# EAGLE design steady_mega_shield_v1.4 (EAGLE 9.4.1)
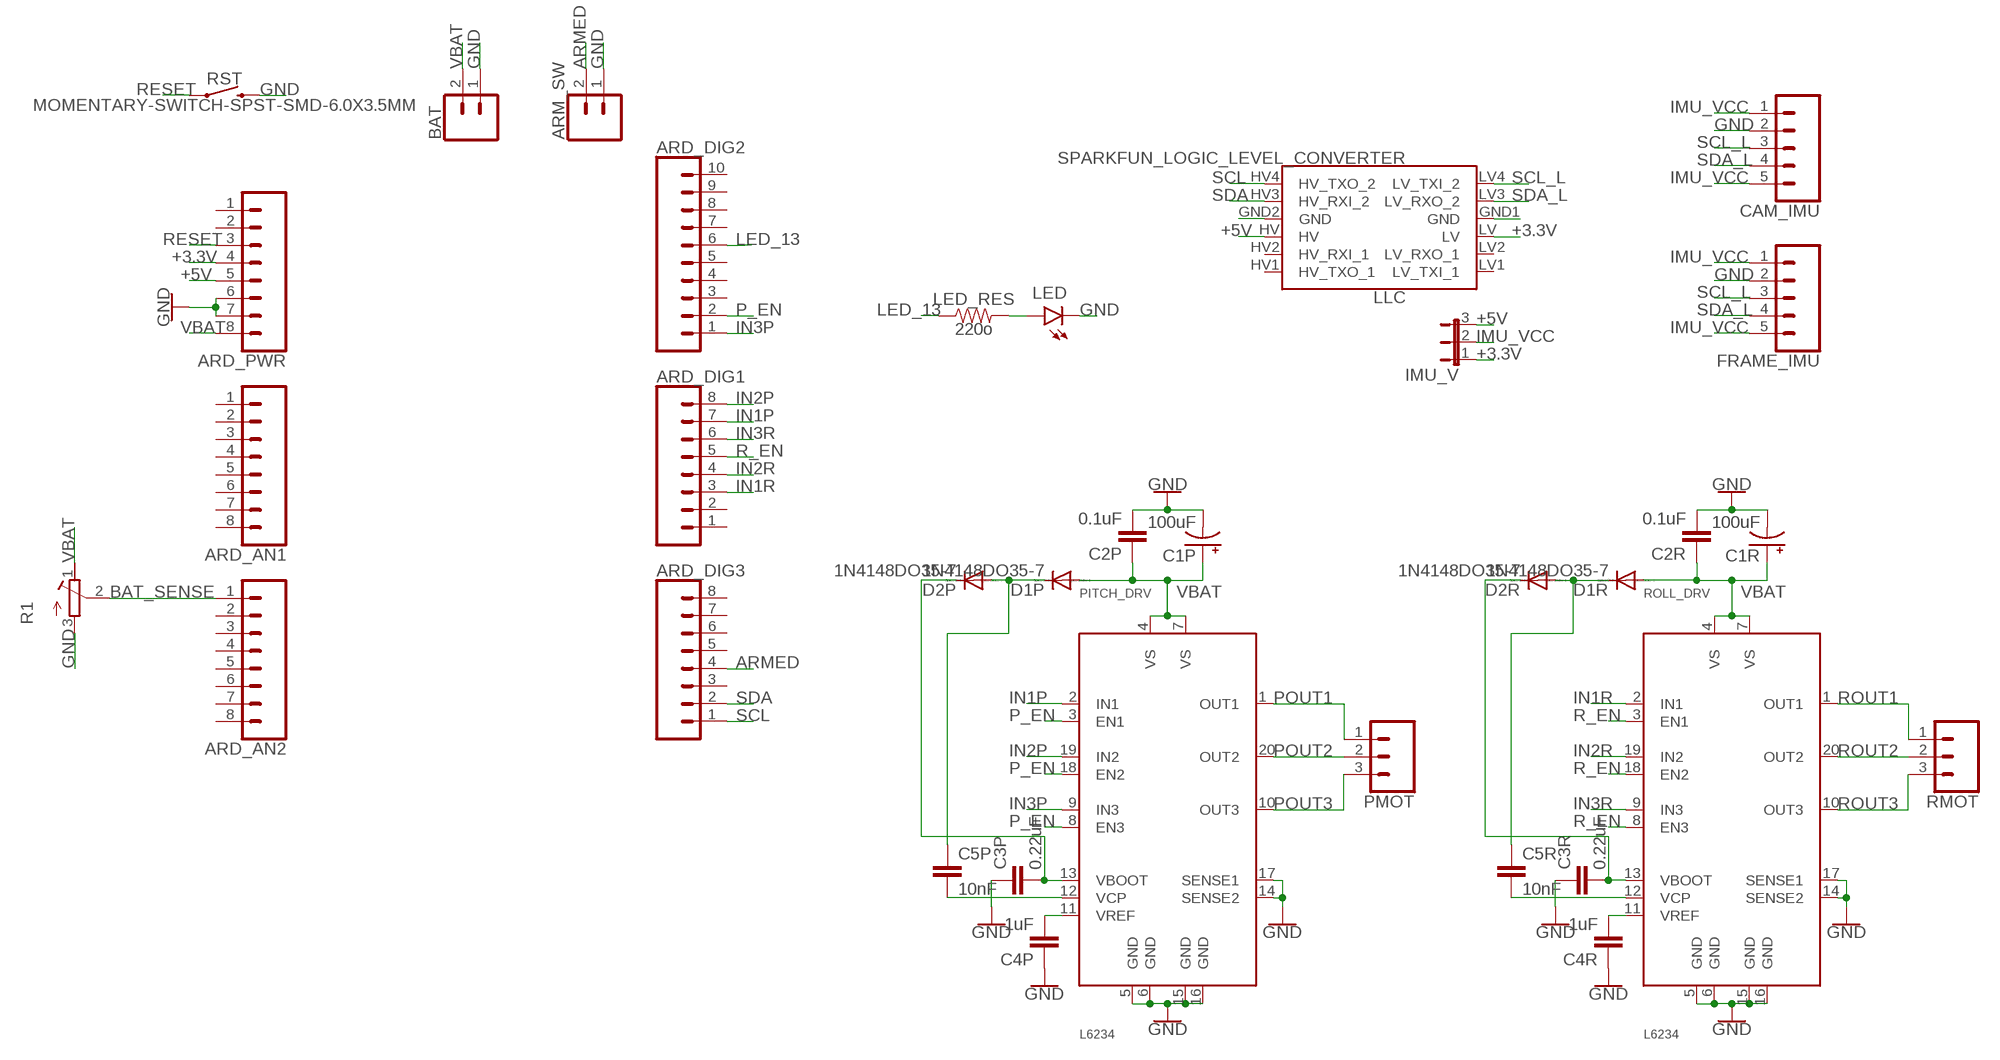
[diagram p0: schematic, sheet 1]

## Parts
ARD_AN1  CONN_08"  [1X08]
ARD_AN2  CONN_08"  [1X08]
ARD_DIG1  CONN_08"  [1X08]
ARD_DIG2  CONN_10"  [1X10]
ARD_DIG3  CONN_08"  [1X08]
ARD_PWR  CONN_08"  [1X08]
ARM_SW  CONN_02  [1X02]
BAT  CONN_02  [1X02]
C1P  100uF  100UF-POLAR-RADIAL-2.5MM-25V-20%  [CPOL-RADIAL-2.5MM-6.5MM]
C1R  100uF  100UF-POLAR-RADIAL-2.5MM-25V-20%  [CPOL-RADIAL-2.5MM-6.5MM]
C2P  0.1uF  C-EU025-024X044  [C025-024X044]
C2R  0.1uF  C-EU025-024X044  [C025-024X044]
C3P  0.22uF  C5/2.5  [C5B2.5]
C3R  0.22uF  C5/2.5  [C5B2.5]
C4P  1uF  C5/5.5  [C5B5.5]
C4R  1uF  C5/5.5  [C5B5.5]
C5P  10nF  C5/2.5  [C5B2.5]
C5R  10nF  C5/2.5  [C5B2.5]
CAM_IMU  CONN_05JST  [JST-5-PTH]
D1P  1N4148DO35-7  [DO35-7]
D1R  1N4148DO35-7  [DO35-7]
D2P  1N4148DO35-7  [DO35-7]
D2R  1N4148DO35-7  [DO35-7]
FRAME_IMU  CONN_05JST  [JST-5-PTH]
IMU_V  JP2E  [JP2]
LED  LED3MM  [LED_3MM]
LED_RES  220o  RESISTOR0805  [0805]
LLC  SPARKFUN_LOGIC_LEVEL_CONVERTER  [SPARKFUN_LOGIC_LEVEL_CONVERTER]
PITCH_DRV  L6234  [DIL20]
PMOT  CONN_03POLAR  [MOLEX-1X3]
R1  R-TRIMMT93XB  [RTRIMT93XB]
RMOT  CONN_03POLAR  [MOLEX-1X3]
ROLL_DRV  L6234  [DIL20]
RST  MOMENTARY-SWITCH-SPST-SMD-6.0X3.5MM  [TACTILE_SWITCH_SMD_6.0X3.5MM]

## Nets
+3.3V: ARD_PWR.4 IMU_V.1 LLC.LV
+5V: ARD_PWR.5 IMU_V.3 LLC.HV
ARMED: ARD_DIG3.4 ARM_SW.2
BAT_SENSE: ARD_AN2.1 R1.2(S)
GND: ARD_PWR.6 ARD_PWR.7 ARM_SW.1 BAT.1 C1P.2(-) C1R.2(-) C2P.2 C2R.2 C3P.1 C3R.1 C4P.1 C4R.1 CAM_IMU.2 FRAME_IMU.2 LED.K(C) LLC.GND1(GND) LLC.GND2(GND) PITCH_DRV.5(GND) PITCH_DRV.6(GND) PITCH_DRV.14(SENSE2) PITCH_DRV.15(GND) PITCH_DRV.16(GND) PITCH_DRV.17(SENSE1) R1.3(A) ROLL_DRV.5(GND) ROLL_DRV.6(GND) ROLL_DRV.14(SENSE2) ROLL_DRV.15(GND) ROLL_DRV.16(GND) ROLL_DRV.17(SENSE1) RST.2
IMU_VCC: CAM_IMU.1 CAM_IMU.5 FRAME_IMU.1 FRAME_IMU.5 IMU_V.2
IN1P: ARD_DIG1.7 PITCH_DRV.2(IN1)
IN1R: ARD_DIG1.3 ROLL_DRV.2(IN1)
IN2P: ARD_DIG1.8 PITCH_DRV.19(IN2)
IN2R: ARD_DIG1.4 ROLL_DRV.19(IN2)
IN3P: ARD_DIG2.1 PITCH_DRV.9(IN3)
IN3R: ARD_DIG1.6 ROLL_DRV.9(IN3)
LED_13: ARD_DIG2.6 LED_RES.1
N$1: C4R.2 ROLL_DRV.11(VREF)
N$2: C4P.2 PITCH_DRV.11(VREF)
N$3: C5R.2 ROLL_DRV.12(VCP)
N$4: C3R.2 D2R.C ROLL_DRV.13(VBOOT)
N$5: C5P.2 PITCH_DRV.12(VCP)
N$6: C3P.2 D2P.C PITCH_DRV.13(VBOOT)
N$7: LED.A LED_RES.2
N$13: C5P.1 D1P.C D2P.A
N$14: C5R.1 D1R.C D2R.A
P_EN: ARD_DIG2.2 PITCH_DRV.3(EN1) PITCH_DRV.8(EN3) PITCH_DRV.18(EN2)
POUT1: PITCH_DRV.1(OUT1) PMOT.1
POUT2: PITCH_DRV.20(OUT2) PMOT.2
POUT3: PITCH_DRV.10(OUT3) PMOT.3
R_EN: ARD_DIG1.5 ROLL_DRV.3(EN1) ROLL_DRV.8(EN3) ROLL_DRV.18(EN2)
RESET: ARD_PWR.3 RST.1
ROUT1: RMOT.1 ROLL_DRV.1(OUT1)
ROUT2: RMOT.2 ROLL_DRV.20(OUT2)
ROUT3: RMOT.3 ROLL_DRV.10(OUT3)
SCL: ARD_DIG3.1 LLC.HV4(HV_TXO_2)
SCL_L: CAM_IMU.3 FRAME_IMU.3 LLC.LV4(LV_TXI_2)
SDA: ARD_DIG3.2 LLC.HV3(HV_RXI_2)
SDA_L: CAM_IMU.4 FRAME_IMU.4 LLC.LV3(LV_RXO_2)
VBAT: ARD_PWR.8 BAT.2 C1P.1(+) C1R.1(+) C2P.1 C2R.1 D1P.A D1R.A PITCH_DRV.4(VS) PITCH_DRV.7(VS) R1.1(E) ROLL_DRV.4(VS) ROLL_DRV.7(VS)
Unconnected: ARD_AN1.1 ARD_AN1.2 ARD_AN1.3 ARD_AN1.4 ARD_AN1.5 ARD_AN1.6 ARD_AN1.7 ARD_AN1.8 ARD_AN2.2 ARD_AN2.3 ARD_AN2.4 ARD_AN2.5 ARD_AN2.6 ARD_AN2.7 ARD_AN2.8 ARD_DIG1.1 ARD_DIG1.2 ARD_DIG2.3 ARD_DIG2.4 ARD_DIG2.5 ARD_DIG2.7 ARD_DIG2.8 ARD_DIG2.9 ARD_DIG2.10 ARD_DIG3.3 ARD_DIG3.5 ARD_DIG3.6 ARD_DIG3.7 ARD_DIG3.8 ARD_PWR.1 ARD_PWR.2 LLC.HV1(HV_TXO_1) LLC.HV2(HV_RXI_1) LLC.LV1(LV_TXI_1) LLC.LV2(LV_RXO_1)

## Library data of the parts
ARD_AN1 ARD_AN2 ARD_DIG1 ARD_DIG3 ARD_PWR = SparkFun-Connectors:CONN_08: Multi connection point. Often used as Generic Header-pin footprint for 0.1 inch spaced/style header connections On any of the 0.1 inch spaced packages, you can populate with these: Break Away Headers - Straight <https://www.sparkfun.com/products/116> (PRT-00116) Break Away Male Headers - Right Angle <https://www.sparkfun.com/products/553> (PRT-00553) Female Headers <https://www.sparkfun.com/products/115> (PRT-00115) Break Away Headers - Machine Pin <https://www.sparkfun.com/products/117> (PRT-00117) Break Away Female Headers - Swiss Machine Pin <https://www.sparkfun.com/products/743> (PRT-00743) Arduino Stackable Header - 8 Pin <https://www.sparkfun.com/products/9279> (PRT-09279) For SCREWTERMINALS and SPRING TERMINALS visit here: Screw Terimnals on SparkFun.com <https://www.sparkfun.com/search/results?term=Screw+Terminals> (5mm/3.5mm/2.54mm spacing) This device is also useful as a general connection point to wire up your design to another part of your project. Our various solder wires solder well into these plated through hole pads. Hook-Up Wire - Assortment (Stranded, 22 AWG) <https://www.sparkfun.com/products/11375> (PRT-11375) Hook-Up Wire - Assortment (Solid Core, 22 AWG) <https://www.sparkfun.com/products/11367> (PRT-11367) View the entire wire category on our website here <https://www.sparkfun.com/categories/141> Special notes: Molex polarized connector foot print use with SKU : PRT-08231 with associated crimp pins and housings. 1MM SMD Version SKU: PRT-10208 NOTES ON THE VARIANTS LOCK and LOCK_LONGPADS... This footprint was designed to help hold the alignment of a through-hole component (i.e. 6-pin header) while soldering it into place. You may notice that each hole has been shifted either up or down by 0.005 of an inch from it's more standard position (which is a perfectly straight line). This slight alteration caused the pins (the squares in the middle) to touch the edges of the holes. Because they are alternating, it causes a "brace" to hold the component in place. 0.005 has proven to be the perfect amount of "off-center" position when using our standard breakaway headers. Although looks a little odd when you look at the bare footprint, once you have a header in there, the alteration is very hard to notice. Also,if you push a header all the way into place, it is covered up entirely on the bottom side.; PROD_ID: CONN-08438
ARD_DIG2 = SparkFun-Connectors:CONN_10: Multi connection point. Often used as Generic Header-pin footprint for 0.1 inch spaced/style header connections On any of the 0.1 inch spaced packages, you can populate with these: Break Away Headers - Straight <https://www.sparkfun.com/products/116> (PRT-00116) Break Away Male Headers - Right Angle <https://www.sparkfun.com/products/553> (PRT-00553) Female Headers <https://www.sparkfun.com/products/115> (PRT-00115) Break Away Headers - Machine Pin <https://www.sparkfun.com/products/117> (PRT-00117) Break Away Female Headers - Swiss Machine Pin <https://www.sparkfun.com/products/743> (PRT-00743) Arduino Stackable Header - 10 Pin <https://www.sparkfun.com/products/11376> (PRT-11376) For SCREWTERMINALS and SPRING TERMINALS visit here: Screw Terimnals on SparkFun.com <https://www.sparkfun.com/search/results?term=Screw+Terminals> (5mm/3.5mm/2.54mm spacing) This device is also useful as a general connection point to wire up your design to another part of your project. Our various solder wires solder well into these plated through hole pads. Hook-Up Wire - Assortment (Stranded, 22 AWG) <https://www.sparkfun.com/products/11375> (PRT-11375) Hook-Up Wire - Assortment (Solid Core, 22 AWG) <https://www.sparkfun.com/products/11367> (PRT-11367) View the entire wire category on our website here <https://www.sparkfun.com/categories/141> Special notes: Molex polarized connector foot print use with SKU : PRT-08231 with associated crimp pins and housings. 1MM SMD Version SKU: PRT-10208 NOTES ON THE VARIANTS LOCK and LOCK_LONGPADS... This footprint was designed to help hold the alignment of a through-hole component (i.e. 6-pin header) while soldering it into place. You may notice that each hole has been shifted either up or down by 0.005 of an inch from it's more standard position (which is a perfectly straight line). This slight alteration caused the pins (the squares in the middle) to touch the edges of the holes. Because they are alternating, it causes a "brace" to hold the component in place. 0.005 has proven to be the perfect amount of "off-center" position when using our standard breakaway headers. Although looks a little odd when you look at the bare footprint, once you have a header in there, the alteration is very hard to notice. Also,if you push a header all the way into place, it is covered up entirely on the bottom side.; PROD_ID: CONN-11563
ARM_SW BAT = SparkFun-Connectors:CONN_02: Multi connection point. Often used as Generic Header-pin footprint for 0.1 inch spaced/style header connections On any of the 0.1 inch spaced packages, you can populate with these: Break Away Headers - Straight <https://www.sparkfun.com/products/116> (PRT-00116) Break Away Male Headers - Right Angle <https://www.sparkfun.com/products/553> (PRT-00553) Female Headers <https://www.sparkfun.com/products/115> (PRT-00115) Break Away Headers - Machine Pin <https://www.sparkfun.com/products/117> (PRT-00117) Break Away Female Headers - Swiss Machine Pin <https://www.sparkfun.com/products/743> (PRT-00743) For SCREWTERMINALS and SPRING TERMINALS visit here: Screw Terimnals on SparkFun.com <https://www.sparkfun.com/search/results?term=Screw+Terminals> (5mm/3.5mm/2.54mm spacing) This device is also useful as a general connection point to wire up your design to another part of your project. Our various solder wires solder well into these plated through hole pads. Hook-Up Wire - Assortment (Stranded, 22 AWG) <https://www.sparkfun.com/products/11375> (PRT-11375) Hook-Up Wire - Assortment (Solid Core, 22 AWG) <https://www.sparkfun.com/products/11367> (PRT-11367) View the entire wire category on our website here <https://www.sparkfun.com/categories/141> Special notes: Molex polarized connector foot print use with: PRT-08233 with associated crimp pins and housings. 2.54_SCREWTERM for use with PRT-10571. 3.5mm Screw Terminal footprints for PRT-08084 5mm Screw Terminal footprints for use with PRT-08432
C1P C1R = SparkFun-Capacitors:100UF-POLAR: 100µF polarized capacitors A capacitor is a passive two-terminal electrical component used to store electrical energy temporarily in an electric field.; PROD_ID: CAP-08439
C2P C2R = resistor:C-EU: CAPACITOR, European symbol
C3P C3R C4P C4R C5P C5R = capacitor-wima:C: CAPACITOR naming: grid - package width
CAM_IMU FRAME_IMU = SparkFun-Connectors:CONN_05: Multi connection point. Often used as Generic Header-pin footprint for 0.1 inch spaced/style header connections On any of the 0.1 inch spaced packages, you can populate with these: Break Away Headers - Straight <https://www.sparkfun.com/products/116> (PRT-00116) Break Away Male Headers - Right Angle <https://www.sparkfun.com/products/553> (PRT-00553) Female Headers <https://www.sparkfun.com/products/115> (PRT-00115) Break Away Headers - Machine Pin <https://www.sparkfun.com/products/117> (PRT-00117) Break Away Female Headers - Swiss Machine Pin <https://www.sparkfun.com/products/743> (PRT-00743) For SCREWTERMINALS and SPRING TERMINALS visit here: Screw Terimnals on SparkFun.com <https://www.sparkfun.com/search/results?term=Screw+Terminals> (5mm/3.5mm/2.54mm spacing) This device is also useful as a general connection point to wire up your design to another part of your project. Our various solder wires solder well into these plated through hole pads. Hook-Up Wire - Assortment (Stranded, 22 AWG) <https://www.sparkfun.com/products/11375> (PRT-11375) Hook-Up Wire - Assortment (Solid Core, 22 AWG) <https://www.sparkfun.com/products/11367> (PRT-11367) View the entire wire category on our website here <https://www.sparkfun.com/categories/141> Special notes: Molex polarized connector foot print use with SKU : PRT-08231 with associated crimp pins and housings. 1MM SMD Version SKU: PRT-10208; SF_ID: PRT-09917
D1P D1R D2P D2R = diode:1N4148: DIODE high speed (Philips)
IMU_V = jumper:JP2E: JUMPER
LED = SparkFun-LED:LED: LED (Generic) Standard schematic elements and footprints for 5mm, 3mm, 1206, and 0603 sized LEDs. Generic LEDs with no color specified.; PROD_ID: DIO-08794
LED_RES = SparkFun-Resistors:RESISTOR: Generic Resistor Package
LLC = SparkFun-Boards:SPARKFUN_LOGIC_LEVEL_CONVERTER: SparkFun Logic Level Converter -Bi-Directional This is the mechnical outline for the 3.3V - 5V bi directional logic level converter. *Note, the "LOCK" Package has the header pins staggered by an offset of 5 mils (off center line), so that when you slide a row of standard 0.1" headers into the PTH pads, it will hold position vertically. See the follwing turorial for more information on this type of special footprints: Sneaky Footprints <https://www.sparkfun.com/tutorials/114> SparkFun Products: SparkFun Logic Level Converter - Bi-Directional <https://www.sparkfun.com/products/12009>
PITCH_DRV ROLL_DRV = gto:L6234
PMOT RMOT = SparkFun-Connectors:CONN_03: Multi connection point. Often used as Generic Header-pin footprint for 0.1 inch spaced/style header connections On any of the 0.1 inch spaced packages, you can populate with these: Break Away Headers - Straight <https://www.sparkfun.com/products/116> (PRT-00116) Break Away Male Headers - Right Angle <https://www.sparkfun.com/products/553> (PRT-00553) Female Headers <https://www.sparkfun.com/products/115> (PRT-00115) Break Away Headers - Machine Pin <https://www.sparkfun.com/products/117> (PRT-00117) Break Away Female Headers - Swiss Machine Pin <https://www.sparkfun.com/products/743> (PRT-00743) Stackable Header - 3 Pin (Female, 0.1") <https://www.sparkfun.com/products/13875> (PRT-13875) For SCREWTERMINALS and SPRING TERMINALS visit here: Screw Terimnals on SparkFun.com <https://www.sparkfun.com/search/results?term=Screw+Terminals> (5mm/3.5mm/2.54mm spacing) This device is also useful as a general connection point to wire up your design to another part of your project. Our various solder wires solder well into these plated through hole pads. Hook-Up Wire - Assortment (Stranded, 22 AWG) <https://www.sparkfun.com/products/11375> (PRT-11375) Hook-Up Wire - Assortment (Solid Core, 22 AWG) <https://www.sparkfun.com/products/11367> (PRT-11367) View the entire wire category on our website here <https://www.sparkfun.com/categories/141> Special notes: Molex polarized connector foot print use with SKU : PRT-08232 with associated crimp pins and housings.; PROD_ID: CONN-08625; SF_ID: PRT-08096
R1 = rcl:R-TRIMM: Trimm resistor; SPICEMODEL: X; SPICEPREFIXL: POT
RST = SparkFun-Switches:MOMENTARY-SWITCH-SPST: Momentary Switch (Pushbutton) - SPST Normally-open (NO) SPST momentary switches (buttons, pushbuttons). Variants PTH-12MM - 12mm square, through-hole Momentary Pushbutton Switch - 12mm Square <https://www.sparkfun.com/products/9190> (COM-09190) PTH-6.0MM, PTH-6.0MM-KIT - 6.0mm square, through-hole Mini Pushbutton Switch <https://www.sparkfun.com/products/97> (COM-00097) KIT package intended for soldering kit's - only one side of pads' copper is exposed. PTH-RIGHT-ANGLE-KIT - Right-angle, through-hole Right Angle Tactile Button <https://www.sparkfun.com/products/10791> - Used on SparkFun BigTime Watch Kit <https://www.sparkfun.com/products/11734> SMD-12MM - 12mm square, surface-mount Tactile Button - SMD (12mm) <https://www.sparkfun.com/products/12993> (COM-12993) Used on SparkFun PicoBoard <https://www.sparkfun.com/products/11888> SMD-4.5MM - 4.5mm Square Trackball Switch Used on SparkFun Blackberry Trackballer Breakout <https://www.sparkfun.com/products/13169> SMD-4.6MMX2.8MM - 4.60mm x 2.80mm, surface mount Used on SparkFun SAMD21 Mini Breakout <https://www.sparkfun.com/products/13664> SMD-5.2MM, SMD-5.2-REDUNDANT - 5.2mm square, surface-mount Mini Pushbutton Switch - SMD <https://www.sparkfun.com/products/8720> (COM-08720) Used on Arduino Pro Mini <https://www.sparkfun.com/products/11114> REDUNDANT package connects both switch circuits together SMD-6.0X3.5MM - 6.0 x 3.5mm, surface mount Momentary Reset Switch SMD <https://www.sparkfun.com/products/8229> (COM-08229) SMD-6.2MM-TALL - 6.2mm square, surface mount Tactile Button - SMD (6mm) <https://www.sparkfun.com/products/12992> Used on SparkFun Digital Sandbox <https://www.sparkfun.com/products/12651> SMD-RIGHT-ANGLE - Right-angle, surface mount Used on SparkFun Block for Intel® Edison - Arduino <https://www.sparkfun.com/products/13036>; PROD_ID: SWCH-00815; SF_SKU: COM-08229

## Board
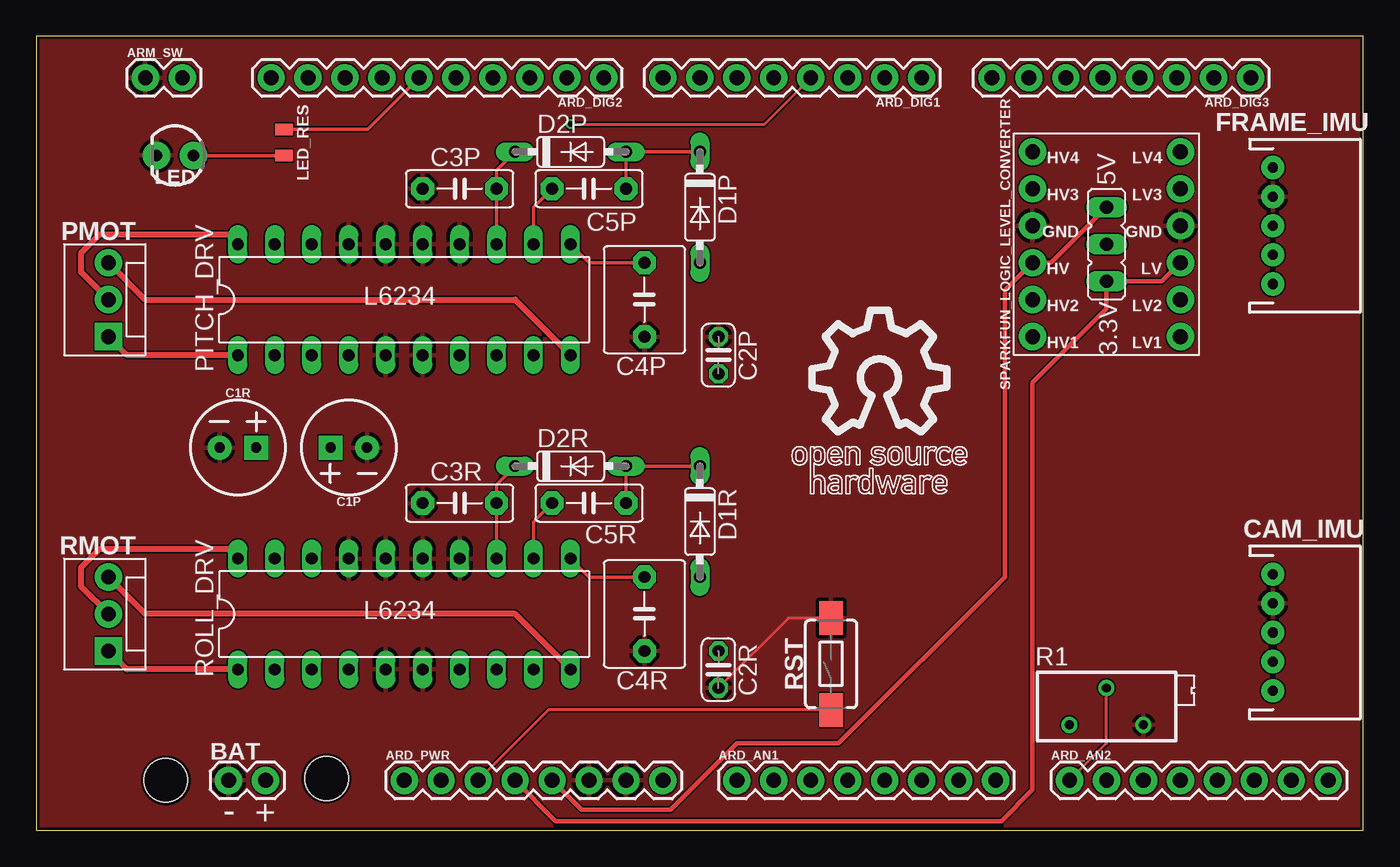
[diagram p1: board, top side]
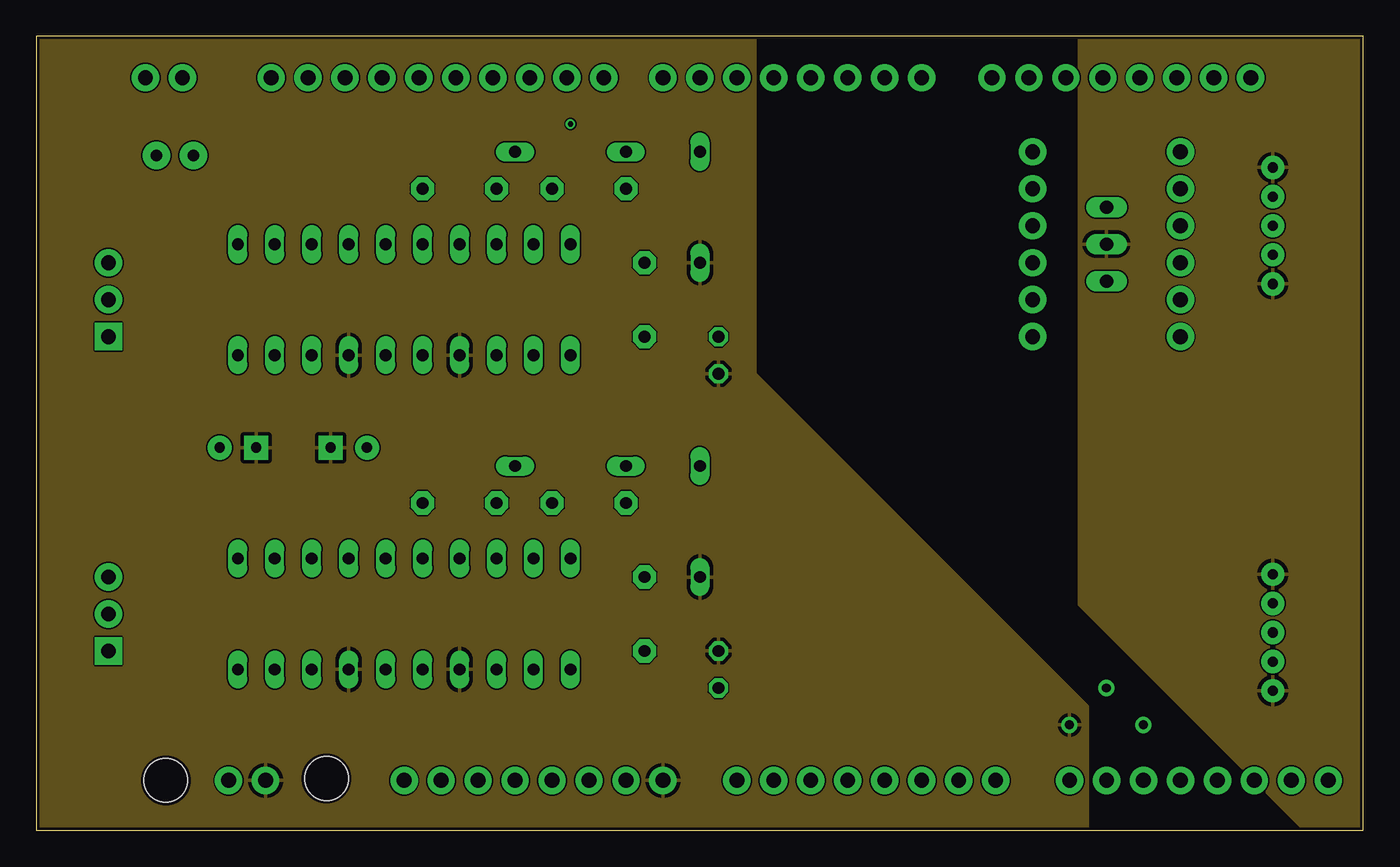
[diagram p2: board, inner layer Route2]
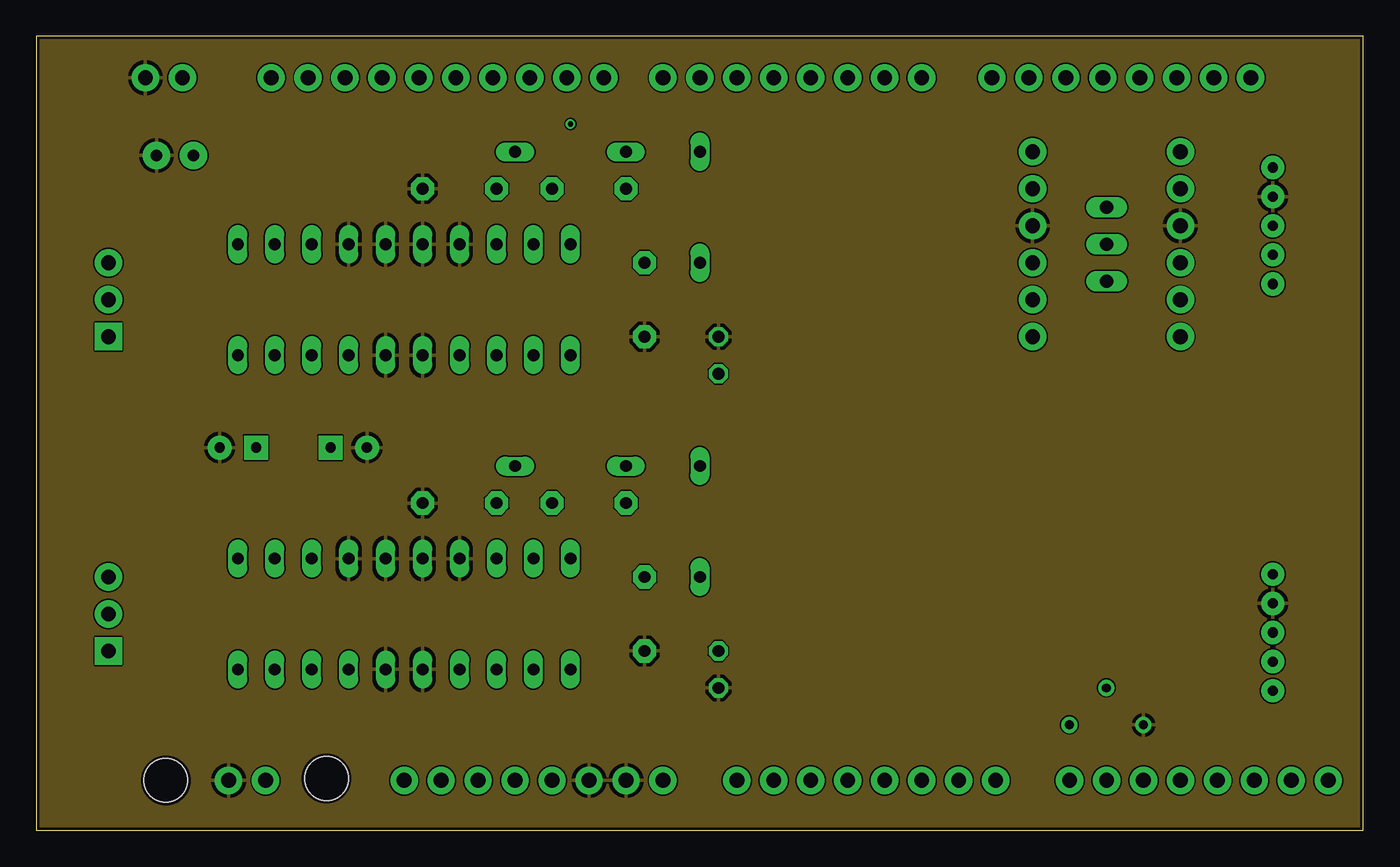
[diagram p3: board, inner layer Route15]
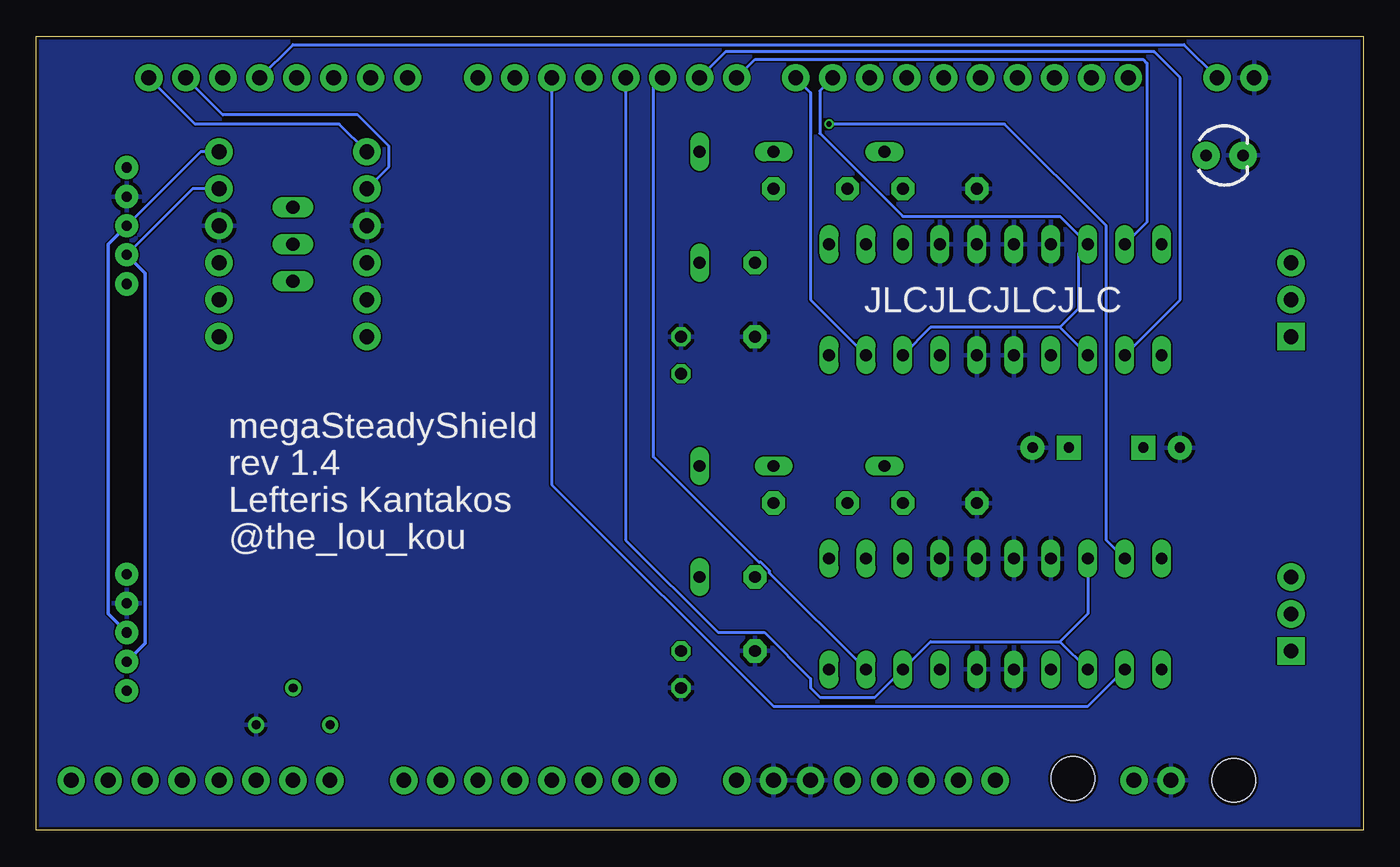
[diagram p4: board, bottom side, seen from below]

Size 91.17 x 54.53 mm. Coordinates in mm from the lower left corner, seen from the top.
Outline: 0,0 91.17,0 91.17,54.53 0,54.53 0,0
Copper layers (1*2*15*16): Top 0.035mm / dielectric 0.2mm / Route2 0.018mm / dielectric 1.5mm / Route15 0.018mm / dielectric 0.2mm / Bottom 0.035mm
Design rules "aisler_4_layer *": minimum track width 0.1mm, minimum drill 0.2mm, track to track 0.1mm, track to pad 0.1mm, pad to pad 0.1mm, via to via 0.1mm, smd to smd 0.1mm, copper to edge 0.2mm, drill to drill 0.21mm, minimum pad ring 0.25mm, minimum via ring 0.15mm, stop-mask expansion 0mil, vias tented up to drill 0mil, thermal gap 10mil
Holes 3 mm at 19.94,3.56 8.89,3.43

### Footprints (pad centres in the part's own frame; a part is rotated, then mirrored left to right if it is on the bottom)
1X08 = drill 1.016 pad 1.88: 1 0,0; 2 2.54,0; 3 5.08,0; 4 7.62,0; 5 10.16,0; 6 12.7,0; 7 15.24,0; 8 17.78,0
1X10 = drill 1.016 pad 1.88: 1 0,0; 2 2.54,0; 3 5.08,0; 4 7.62,0; 5 10.16,0; 6 12.7,0; 7 15.24,0; 8 17.78,0; 9 20.32,0; 10 22.86,0
1X02 = drill 1.016 pad 1.88: 1 0,0; 2 2.54,0
CPOL-RADIAL-2.5MM-6.5MM = drill 0.7 pad 1.651 square: 1 1.25,0 | drill 0.7 pad 1.651: 2 -1.25,0
C025-024X044 = drill 0.813 octagon: 1 -1.27,0; 2 1.27,0
C5B2.5 = drill 0.813 pad 1.6 octagon: 1 -2.54,0; 2 2.54,0
C5B5.5 = drill 0.813 pad 1.6 octagon: 1 -2.54,0; 2 2.54,0
JST-5-PTH = drill 0.7 pad 1.6: 1 -4,0; 2 -2,0; 3 0,0; 4 2,0; 5 4,0
DO35-7 = drill 0.813 long: A 3.81,0; C -3.81,0
JP2 = drill 0.914 long: 1 -2.54,0; 2 0,0; 3 2.54,0
LED_3MM = drill 0.813 pad 1.88: A -1.27,0; K 1.27,0
0805 = smd 0.8 x 1.2: 1 -0.9,0; 2 0.9,0
SPARKFUN_LOGIC_LEVEL_CONVERTER = drill 1.016 pad 1.88: GND1 -5.08,-1.27; GND2 5.08,-1.27; HV 5.08,1.27; HV1 5.08,6.35; HV2 5.08,3.81; HV3 5.08,-3.81; HV4 5.08,-6.35; LV -5.08,1.27; LV1 -5.08,6.35; LV2 -5.08,3.81; LV3 -5.08,-3.81; LV4 -5.08,-6.35
DIL20 = drill 0.813 long: 1 -11.43,-3.81; 2 -8.89,-3.81; 3 -6.35,-3.81; 4 -3.81,-3.81; 5 -1.27,-3.81; 6 1.27,-3.81; 7 3.81,-3.81; 8 6.35,-3.81; 9 8.89,-3.81; 10 11.43,-3.81; 11 11.43,3.81; 12 8.89,3.81; 13 6.35,3.81; 14 3.81,3.81; 15 1.27,3.81; 16 -1.27,3.81; 17 -3.81,3.81; 18 -6.35,3.81; 19 -8.89,3.81; 20 -11.43,3.81
MOLEX-1X3 = drill 1.016 pad 1.88 square: 1 0,0 | drill 1.016 pad 1.88: 2 2.54,0; 3 5.08,0
RTRIMT93XB = drill 0.61: 1 1.27,-2.54; 2 -1.27,0; 3 1.27,2.54
TACTILE_SWITCH_SMD_6.0X3.5MM = smd 2.3 x 1.6: 1 -3.15,0; 2 3.15,0

### Placement (x,y rotation side)
ARD_AN1  48.13,3.43 0 top
ARD_AN2  70.99,3.43 0 top
ARD_DIG1  60.83,51.69 180 top
ARD_DIG2  38.99,51.69 180 top
ARD_DIG3  83.44,51.69 180 top
ARD_PWR  25.27,3.43 0 top
ARM_SW  7.49,51.69 0 top
BAT  13.21,3.43 0 top
C1P  21.46,26.29 180 top
C1R  13.84,26.29 0 top
C2P  46.86,32.64 90 top
C2R  46.86,11.05 270 top
C3P  29.08,44.07 0 top
C3R  29.08,22.48 0 top
C4P  41.78,36.45 90 top
C4R  41.78,14.86 90 top
C5P  37.97,44.07 180 top
C5R  37.97,22.48 180 top
CAM_IMU  84.96,13.59 270 top
D1P  45.59,42.8 270 top
D1R  45.59,21.21 270 top
D2P  36.7,46.61 0 top
D2R  36.7,25.02 0 top
FRAME_IMU  84.96,41.53 270 top
IMU_V  73.53,40.26 90 top
LED  9.52,46.36 180 top
LED_RES  17.02,47.24 270 top
LLC  73.53,40.26 180 top
PITCH_DRV  25.27,36.45 0 top
PMOT  4.95,33.91 90 top
R1  73.53,8.51 270 top
RMOT  4.95,12.32 90 top
ROLL_DRV  25.27,14.86 0 top
RST  54.61,11.43 90 top

### Tracks (layer width: path | path; a pad name or v marks a point on that pad's centre or on a via)
+3.3V
  Top 0.3: LLC.LV 77.34,37.72 IMU_V.1 73.53,35.81 68.45,30.73 68.45,2.79 66.29,0.63 35.69,0.63 ARD_PWR.4
+5V
  Top 0.3: IMU_V.3 69.72,38.99 LLC.HV 66.55,37.08 66.55,17.4 55.12,5.97 48.13,5.97 43.56,1.4 37.47,1.4 ARD_PWR.5
ARMED
  Bottom 0.2: ARD_DIG3.4 73.53,53.98 12.32,53.98 ARM_SW.2
BAT_SENSE
  Top 0.2: R1.2 73.53,5.97 ARD_AN2.1
GND
  Top 0.2: RST.2 51.66,14.58 C2R.2
  pour Route15: -0.13,54.86 -0.13,-0.38 91.31,-0.38 91.31,54.86
  pour Top: -0.13,54.86 -0.13,-0.38 91.31,-0.38 91.31,54.86
  pour Bottom: -0.13,54.86 -0.13,-0.38 91.31,-0.38 91.31,54.86
IMU_VCC
  pour Route2: 91.31,54.86 71.63,54.86 71.63,15.49 87.5,-0.38 91.31,-0.38
IN1P
  Bottom 0.2: PITCH_DRV.2 12.57,36.45 12.57,51.69 14.35,53.47 43.81,53.47 ARD_DIG1.7
IN1R
  Bottom 0.2: ARD_DIG1.3 55.75,23.75 40.51,8.51 18.92,8.51 ROLL_DRV.2
IN2P
  Bottom 0.2: ARD_DIG1.8 41.78,52.96 15.11,52.96 14.86,52.71 14.86,41.78 PITCH_DRV.19
IN2R  (via drill 0.35)
  Top 0.2: v36.7,48.51 50.04,48.51 ARD_DIG1.4
  Bottom 0.2: ROLL_DRV.19 17.65,19.94 17.65,41.53 24.64,48.51 v36.7,48.51
IN3P
  Bottom 0.2: ARD_DIG2.1 37.97,50.67 37.97,36.45 PITCH_DRV.9
IN3R
  Bottom 0.2: ROLL_DRV.9 40.78,17.67 40.78,17.81 41.37,18.4 41.51,18.4 48.77,25.65 48.77,51.05 ARD_DIG1.6
LED_13
  Top 0.25: ARD_DIG2.6 22.74,48.14 LED_RES.1
N$1
  Top 0.25: C4R.2 37.97,17.4 ROLL_DRV.11
N$2
  Top 0.25: C4P.2 37.97,38.99 PITCH_DRV.11
N$3
  Top 0.25: ROLL_DRV.12 34.16,21.21 C5R.2
N$4
  Top 0.25: D2R.C 31.62,23.75 C3R.2 ROLL_DRV.13
N$5
  Top 0.25: C5P.2 34.16,42.8 PITCH_DRV.12
N$6
  Top 0.25: PITCH_DRV.13 C3P.2 31.62,45.34 D2P.C
N$7
  Top 0.25: LED_RES.2 11.04,46.34 LED.A
N$13
  Top 0.25: C5P.1 D2P.A D1P.C
N$14
  Top 0.25: D1R.C D2R.A C5R.1
P_EN
  Bottom 0.2: ARD_DIG2.2 37.34,50.8 37.34,47.88 31.62,42.16 20.83,42.16 PITCH_DRV.18 19.56,39.62 19.56,35.81 20.83,34.54 | PITCH_DRV.3 20.83,34.54 | 20.83,34.54 29.72,34.54 PITCH_DRV.8
POUT1
  Top 0.406: PITCH_DRV.1 6.22,32.64 PMOT.1
POUT2
  Top 0.406: PITCH_DRV.20 13.21,40.89 4.32,40.89 3.05,39.62 3.05,38.35 PMOT.2
POUT3
  Top 0.406: PMOT.3 7.49,36.45 32.89,36.45 PITCH_DRV.10
R_EN
  Bottom 0.2: ARD_DIG1.5 50.67,19.94 44.32,13.59 41.15,13.59 37.97,10.41 37.97,9.78 37.34,9.14 33.53,9.14 ROLL_DRV.8 29.72,12.95 20.83,12.95 | 20.83,12.95 ROLL_DRV.3 | ROLL_DRV.18 18.92,14.86 20.83,12.95
RESET
  Top 0.2: RST.1 35.2,8.28 ARD_PWR.3
ROUT1
  Top 0.406: ROLL_DRV.1 6.22,11.05 RMOT.1
ROUT2
  Top 0.406: ROLL_DRV.20 13.21,19.3 4.32,19.3 3.05,18.03 3.05,16.76 RMOT.2
ROUT3
  Top 0.406: ROLL_DRV.10 32.89,14.86 7.49,14.86 RMOT.3
SCL
  Bottom 0.2: LLC.HV4 70.36,48.51 80.26,48.51 ARD_DIG3.1
SCL_L
  Bottom 0.2: LLC.LV4 79.88,46.61 FRAME_IMU.3
  Bottom 0.25: FRAME_IMU.3 86.23,40.26 86.23,14.86 CAM_IMU.3
SDA
  Bottom 0.2: LLC.HV3 66.93,45.59 66.93,46.99 69.09,49.15 78.36,49.15 ARD_DIG3.2
SDA_L
  Bottom 0.2: FRAME_IMU.4 80.42,44.07 LLC.LV3
  Bottom 0.25: FRAME_IMU.4 83.69,38.26 83.69,12.86 CAM_IMU.4
VBAT
  pour Route2: -0.13,54.86 -0.13,-0.38 72.26,-0.38 72.26,8.51 71.63,9.14 49.4,31.37 49.4,54.86

### Text on the board
tPlace: - | +
tNames: 5V | 3.3V
bNames: JLCJLCJLCJLC | megaSteadyShield | rev 1.4 | Lefteris Kantakos | @the_lou_kou